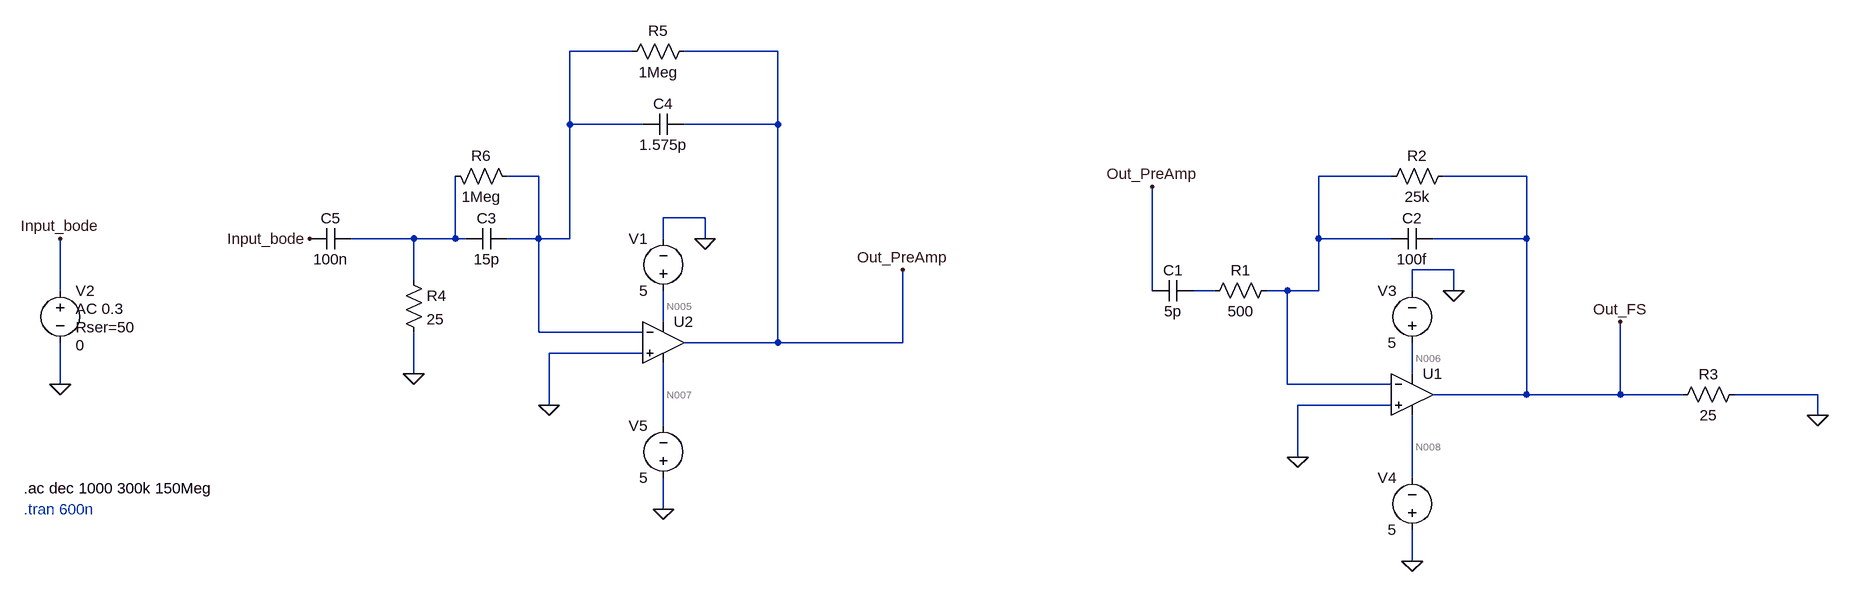
[diagram p0: schematic bode_circuito_completo_con_capacitores_en_preamp.asc]
bode_circuito_completo_con_capacitores_en_preamp.asc, the LTspice schematic file:
Version 4
SHEET 1 2516 1220
WIRE -784 -656 -880 -656
WIRE -560 -656 -704 -656
WIRE -880 -544 -880 -656
WIRE -768 -544 -880 -544
WIRE -560 -544 -560 -656
WIRE -560 -544 -704 -544
WIRE -928 -464 -976 -464
WIRE 384 -464 272 -464
WIRE 592 -464 464 -464
WIRE -672 -400 -736 -400
WIRE -1120 -368 -1216 -368
WIRE -1056 -368 -1056 -464
WIRE -1056 -368 -1120 -368
WIRE -1040 -368 -1056 -368
WIRE -928 -368 -928 -464
WIRE -928 -368 -976 -368
WIRE -880 -368 -880 -544
WIRE -880 -368 -928 -368
WIRE -736 -368 -736 -400
WIRE -672 -368 -672 -400
WIRE 272 -368 272 -464
WIRE 384 -368 272 -368
WIRE 592 -368 592 -464
WIRE 592 -368 448 -368
WIRE 480 -320 416 -320
WIRE -1120 -304 -1120 -368
WIRE -1664 -288 -1664 -368
WIRE 16 -288 16 -448
WIRE 112 -288 80 -288
WIRE 224 -288 192 -288
WIRE 272 -288 272 -368
WIRE 272 -288 224 -288
WIRE 416 -288 416 -320
WIRE 480 -288 480 -320
WIRE -736 -240 -736 -288
WIRE -928 -224 -928 -368
WIRE -768 -224 -928 -224
WIRE -560 -208 -560 -544
WIRE -560 -208 -704 -208
WIRE -368 -208 -368 -320
WIRE -368 -208 -560 -208
WIRE -768 -192 -912 -192
WIRE -1120 -160 -1120 -224
WIRE 416 -160 416 -208
WIRE -1664 -144 -1664 -208
WIRE 224 -144 224 -288
WIRE 384 -144 224 -144
WIRE 592 -128 592 -368
WIRE 592 -128 448 -128
WIRE 736 -128 736 -240
WIRE 736 -128 592 -128
WIRE 832 -128 736 -128
WIRE 1040 -128 912 -128
WIRE -912 -112 -912 -192
WIRE 384 -112 240 -112
WIRE 1040 -96 1040 -128
WIRE -736 -80 -736 -176
WIRE 240 -32 240 -112
WIRE 416 0 416 -96
WIRE -736 48 -736 0
WIRE 416 128 416 80
FLAG 416 128 0
FLAG 480 -288 0
FLAG 240 -32 0
FLAG 736 -240 Out_FS
FLAG 1040 -96 0
FLAG 16 -448 Out_PreAmp
FLAG -1664 -144 0
FLAG -1664 -368 Input_bode
FLAG -736 48 0
FLAG -672 -368 0
FLAG -912 -112 0
FLAG -368 -320 Out_PreAmp
FLAG -1280 -368 Input_bode
FLAG -1120 -160 0
SYMBOL res 208 -304 R90
WINDOW 0 0 56 VBottom 2
WINDOW 3 32 56 VTop 2
SYMATTR InstName R1
SYMATTR Value 500
SYMBOL res 480 -480 R90
WINDOW 0 0 56 VBottom 2
WINDOW 3 32 56 VTop 2
SYMATTR InstName R2
SYMATTR Value 25k
SYMBOL voltage 416 -192 R180
WINDOW 0 24 96 Left 2
WINDOW 3 24 16 Left 2
WINDOW 123 0 0 Left 0
WINDOW 39 0 0 Left 0
SYMATTR InstName V3
SYMATTR Value 5
SYMBOL voltage 416 96 R180
WINDOW 0 24 96 Left 2
WINDOW 3 24 16 Left 2
WINDOW 123 0 0 Left 0
WINDOW 39 0 0 Left 0
SYMATTR InstName V4
SYMATTR Value 5
SYMBOL OpAmps\\UniversalOpAmp1 416 -128 R0
SYMATTR InstName U1
SYMATTR Value2 Avol=1900 GBW=897.0831Meg Vos=0
SYMBOL res 928 -144 R90
WINDOW 0 0 56 VBottom 2
WINDOW 3 32 56 VTop 2
SYMATTR InstName R3
SYMATTR Value 25
SYMBOL cap 80 -304 R90
WINDOW 0 0 32 VBottom 2
WINDOW 3 32 32 VTop 2
SYMATTR InstName C1
SYMATTR Value 5p
SYMBOL cap 448 -384 R90
WINDOW 0 0 32 VBottom 2
WINDOW 3 32 32 VTop 2
SYMATTR InstName C2
SYMATTR Value 100f
SYMBOL voltage -736 -272 R180
WINDOW 0 24 96 Left 2
WINDOW 3 24 16 Left 2
WINDOW 123 0 0 Left 0
WINDOW 39 0 0 Left 0
SYMATTR InstName V1
SYMATTR Value 5
SYMBOL voltage -736 16 R180
WINDOW 0 24 96 Left 2
WINDOW 3 24 16 Left 2
WINDOW 123 0 0 Left 0
WINDOW 39 0 0 Left 0
SYMATTR InstName V5
SYMATTR Value 5
SYMBOL OpAmps\\UniversalOpAmp1 -736 -208 R0
SYMATTR InstName U2
SYMATTR Value2 Avol=1900 GBW=897.0831Meg Vos=0
SYMBOL voltage -1664 -304 R0
WINDOW 123 24 44 Left 2
WINDOW 39 24 72 Left 2
WINDOW 3 24 100 Left 2
SYMATTR Value2 AC 0.3
SYMATTR SpiceLine Rser=50
SYMATTR InstName V2
SYMATTR Value 0
SYMBOL cap -976 -384 R90
WINDOW 0 0 32 VBottom 2
WINDOW 3 32 32 VTop 2
SYMATTR InstName C3
SYMATTR Value 15p
SYMBOL cap -704 -560 R90
WINDOW 0 0 32 VBottom 2
WINDOW 3 32 32 VTop 2
SYMATTR InstName C4
SYMATTR Value 1.575p
SYMBOL res -1136 -320 R0
SYMATTR InstName R4
SYMATTR Value 25
SYMBOL res -688 -672 R90
WINDOW 0 0 56 VBottom 2
WINDOW 3 32 56 VTop 2
SYMATTR InstName R5
SYMATTR Value 1Meg
SYMBOL res -1072 -480 M90
WINDOW 0 0 56 VBottom 2
WINDOW 3 32 56 VTop 2
SYMATTR InstName R6
SYMATTR Value 1Meg
SYMBOL cap -1216 -384 R90
WINDOW 0 0 32 VBottom 2
WINDOW 3 32 32 VTop 2
SYMATTR InstName C5
SYMATTR Value 100n
TEXT -1720 48 Left 2 ;.tran 600n
TEXT -1720 16 Left 2 !.ac dec 1000 300k 150Meg

The netlist it stands for:
* bode_circuito_completo_con_capacitores_en_preamp.asc
R1 N002 N004 500
R2 Out_FS N002 25k
V3 N006 0 5
V4 0 N008 5
XU1 0 N002 N006 N008 Out_FS level1 Avol=1900 GBW=897.0831Meg Vos=0 En=0 Enk=0 In=0 Ink=0 Rin=500Meg  ; pins In+ In- V+ V- OUT
R3 0 Out_FS 25
C1 N004 Out_PreAmp 5p
C2 Out_FS N002 100f
V1 N005 0 5
V5 0 N007 5
XU2 0 N001 N005 N007 Out_PreAmp level1 Avol=1900 GBW=897.0831Meg Vos=0 En=0 Enk=0 In=0 Ink=0 Rin=500Meg  ; pins In+ In- V+ V- OUT
V2 Input_bode 0 0 AC 0.3 Rser=50
C3 N001 N003 15p
C4 Out_PreAmp N001 1.575p
R4 N003 0 25
R5 Out_PreAmp N001 1Meg
R6 N003 N001 1Meg
C5 N003 Input_bode 100n
* .tran 600n
.ac dec 1000 300k 150Meg
.lib UniversalOpAmp1.lib
.backanno
.end

* Results of the author's LTspice run, read from the files saved beside the schematic
* Operating Point, zero values left out:
*   V(n006) = 5 V
*   V(n008) = -5 V
*   V(n005) = 5 V
*   V(n007) = -5 V
*   I(V3) = -10 nA
*   I(V4) = -10 nA
*   I(V1) = -10 nA
*   I(V5) = -10 nA
*   Ix(u1:3) = 10 nA
*   Ix(u1:4) = -10 nA
*   Ix(u2:3) = 10 nA
*   Ix(u2:4) = -10 nA
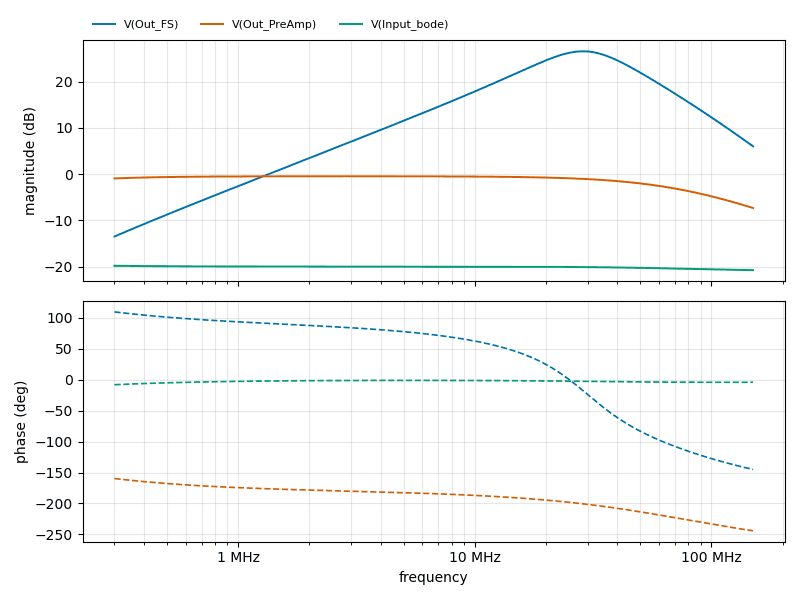
[diagram p1: AC Analysis of bode_circuito_completo_con_capacitores_en_preamp.asc, plotted from the saved traces]
* AC Analysis, 1 run:
*   V(Out_FS): -13.50 dB at 300 kHz, 6.00 dB at 150 MHz, peak 26.55 dB at 28.65 MHz, 3 dB below the peak at 17.88 MHz and 43.95 MHz
*   V(Out_PreAmp): -0.94 dB at 300 kHz, -7.34 dB at 150 MHz, peak -0.48 dB at 2.793 MHz, 3 dB below the peak at 76.48 MHz
*   V(Input_bode): -19.83 dB at 300 kHz, -20.78 dB at 150 MHz, peak -19.83 dB at 300 kHz